# EAGLE design HPLEDShield-v2.5 (EAGLE 6.4)
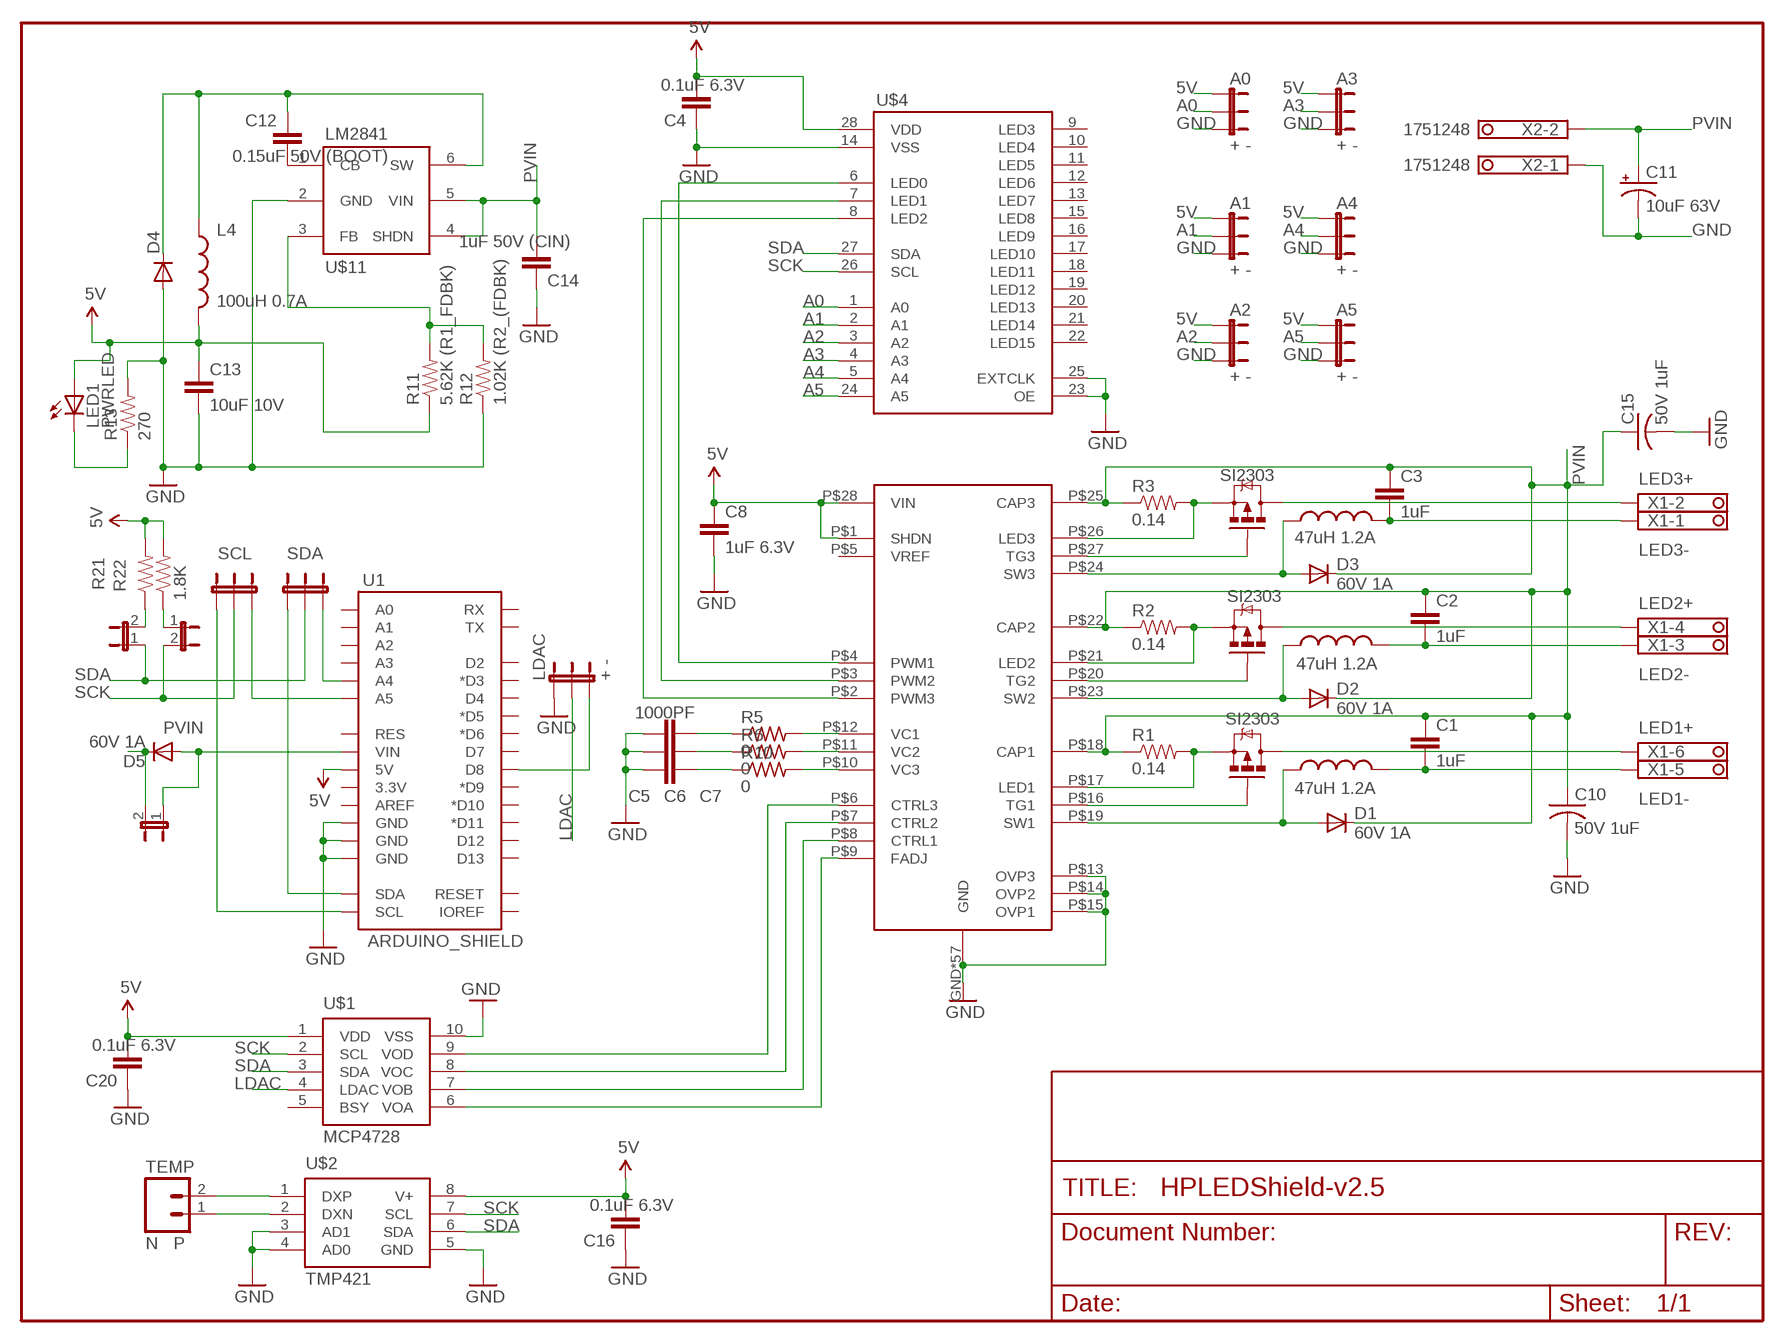
[diagram p0: schematic, sheet 1]

## Parts
A0  + -  JUMPER-3SMD  [SJ_3]
A1  + -  JUMPER-3SMD  [SJ_3]
A2  + -  JUMPER-3SMD  [SJ_3]
A3  + -  JUMPER-3SMD  [SJ_3]
A4  + -  JUMPER-3SMD  [SJ_3]
A5  + -  JUMPER-3SMD  [SJ_3]
C1  1uF  CAP0805  [0805]
C2  1uF  CAP0805  [0805]
C3  1uF  CAP0805  [0805]
C4  0.1uF 6.3V  CAP0402-CAP  [0402-CAP]
C5  1000PF  CAP0402-CAP  [0402-CAP]
C6  1000PF  CAP0402-CAP  [0402-CAP]
C7  1000PF  CAP0402-CAP  [0402-CAP]
C8  1uF 6.3V  CAP0402-CAP  [0402-CAP]
C10  50V 1uF  C-USC1210  [C1210]
C11  10uF 63V  CAP_POLD  [PANASONIC_D]
C12  0.15uF 50V (BOOT)  CAP0603-CAP  [0603-CAP]
C13  10uF 10V  CAP0805  [0805]
C14  1uF 50V (CIN)  CAP1206  [1206]
C15  50V 1uF  C-USC1210  [C1210]
C16  0.1uF 6.3V  CAP0402-CAP  [0402-CAP]
C20  0.1uF 6.3V  CAP0402-CAP  [0402-CAP]
D1  60V 1A  DIODES0D123  [SOD123]
D2  60V 1A  DIODES0D123  [SOD123]
D3  60V 1A  DIODES0D123  [SOD123]
D4  DIODE-SCHOTTKY_ 60V 1A  DIODES0D123  [SOD123]
D5  60V 1A  DIODES0D123  [SOD123]
JP1  PWM3  JUMPER-2SMD-NO  [SJ_2S-NO]
JP2  PWM3  JUMPER-2SMD-NC  [SJ_2S]
JP3  PWM3  JUMPER-2SMD-NC  [SJ_2S]
L1  47uH 1.2A  INDUCTORELL8  [ELL8TP]
L2  47uH 1.2A  INDUCTORELL8  [ELL8TP]
L3  47uH 1.2A  INDUCTORELL8  [ELL8TP]
L4  100uH 0.7A  INDUCTOR6UH  [ELL6UH]
LDAC  + -  JUMPER-3SMD  [SJ_3]
LED1  PWRLED  LED0603  [LED-0603]
LT3496  LT3496  [LT3694_TSSOP]
Q1  SI2303  [SOT-23]
Q2  SI2303  [SOT-23]
Q3  SI2303  [SOT-23]
R1  0.14  RESISTOR0603-RES  [0603-RES]
R2  0.14  RESISTOR0603-RES  [0603-RES]
R3  0.14  RESISTOR0603-RES  [0603-RES]
R5  0  R-US_R0402  [R0402]
R6  0  R-US_R0402  [R0402]
R10  0  R-US_R0402  [R0402]
R11  5.62K (R1_FDBK)  RESISTOR0603-RES  [0603-RES]
R12  1.02K (R2_(FDBK)  RESISTOR0603-RES  [0603-RES]
R13  270  RESISTOR0603-RES  [0603-RES]
R21  1.8K  RESISTOR0402-RES  [0402-RES]
R22  1.8K  RESISTOR0402-RES  [0402-RES]
SCL  JUMPER-3SMD  [SJ_3]
SDA  JUMPER-3SMD  [SJ_3]
TEMP  N P  M02PTH  [1X02]
U1  ARDUINO_SHIELD  ARDUINO_SHIELDNO_SILK  [DUEMILANOVE_VIAS]
U$1  MCP4728  [MSOP10]
U$2  TMP421  [SOT23-8]
U$4  PCA9685  [TSSOP28]
U$11  LM2841  [TSOT-6]
X1  LED1+  1751280  [1751280]
X2  1751248  [1751248]

## Nets
5V: A0.1 A1.1 A2.1 A3.1 A4.1 A5.1 C4.2 C8.1 C13.1 C16.2 C20.2 L4.P$2 LED1.A LT3496.P$1(SHDN) LT3496.P$28(VIN) R11.1 R21.2 R22.2 U1.5V U$1.1(VDD) U$2.8(V+) U$4.28(VDD)
A0: A0.2 U$4.1(A0)
A1: A1.2 U$4.2(A1)
A2: A2.2 U$4.3(A2)
A3: A3.2 U$4.4(A3)
A4: A4.2 U$4.5(A4)
A5: A5.2 U$4.24(A5)
GND: A0.3 A1.3 A2.3 A3.3 A4.3 A5.3 C4.1 C5.1 C6.1 C7.1 C8.2 C10.2 C11.- C13.2 C14.1 C15.2 C16.1 C20.1 D4.2(A) LDAC.1 LT3496.GND LT3496.P$13(OVP3) LT3496.P$14(OVP2) LT3496.P$15(OVP1) LT3496.P$29(GND) LT3496.P$30(GND) LT3496.P$31(GND) LT3496.P$32(GND) LT3496.P$33(GND) LT3496.P$34(GND) LT3496.P$35(GND) LT3496.P$36(GND) LT3496.P$37(GND) LT3496.P$38(GND) LT3496.P$39(GND) LT3496.P$40(GND) LT3496.P$41(GND) LT3496.P$42(GND) LT3496.P$43(GND) LT3496.P$44(GND) LT3496.P$45(GND) LT3496.P$46(GND) LT3496.P$47(GND) LT3496.P$48(GND) LT3496.P$49(GND) LT3496.P$50(GND) LT3496.P$51(GND) LT3496.P$52(GND) LT3496.P$53(GND) LT3496.P$54(GND) LT3496.P$55(GND) LT3496.P$56(GND) LT3496.P$57(GND) LT3496.P$58(GND) LT3496.P$59(GND) LT3496.P$60(GND) LT3496.P$61(GND) LT3496.P$62(GND) LT3496.P$63(GND) LT3496.P$64(GND) LT3496.P$65(GND) LT3496.P$66(GND) LT3496.P$67(GND) LT3496.P$68(GND) LT3496.P$69(GND) LT3496.P$70(GND) LT3496.P$71(GND) LT3496.P$72(GND) LT3496.P$73(GND) LT3496.P$74(GND) LT3496.P$75(GND) LT3496.P$76(GND) LT3496.P$77(GND) LT3496.P$78(GND) LT3496.P$79(GND) LT3496.P$80(GND) LT3496.P$81(GND) LT3496.P$82(GND) LT3496.P$83(GND) LT3496.P$84(GND) R12.1 R13.2 U1.GND@0(GND) U1.GND@1(GND) U1.GND@2(GND) U$1.10(VSS) U$2.3(AD1) U$2.4(AD0) U$2.5(GND) U$4.14(VSS) U$4.23(OE) U$4.25(EXTCLK) U$11.2(GND) X2.1
LDAC: LDAC.2 U$1.4(LDAC)
N$1: JP2.2 R21.1
N$2: JP3.1 R22.1
N$3: LT3496.P$12(VC1) R5.2
N$4: LT3496.P$11(VC2) R6.2
N$5: LT3496.P$10(VC3) R10.2
N$6: C7.2 R5.1
N$7: LDAC.3 U1.D8
N$8: C6.2 R6.1
N$9: C5.2 R10.1
N$10: LT3496.P$8(CTRL1) U$1.7(VOB)
N$11: TEMP.2 U$2.1(DXP)
N$12: TEMP.1 U$2.2(DXN)
N$14: C12.1 D4.1(C) L4.P$1 U$11.6(SW)
N$15: LT3496.P$7(CTRL2) U$1.8(VOC)
N$16: LT3496.P$21(LED2) Q2.2(S) R2.2
N$17: LT3496.P$9(FADJ) U$1.6(VOA)
N$18: LT3496.P$26(LED3) Q3.2(S) R3.2
N$19: LT3496.P$27(TG3) Q3.1(G)
N$20: LT3496.P$6(CTRL3) U$1.9(VOD)
N$21: D3.2(A) L3.P$1 LT3496.P$24(SW3)
N$22: C1.2 L1.P$2 X1.5
N$23: LED1.C R13.1
N$25: C12.2 U$11.1(CB)
N$26: SDA.1 U1.SDA
N$27: SCL.1 U1.SCL
N$29: SDA.3 U1.A4
N$30: SCL.3 U1.A5
N$32: R11.2 R12.2 U$11.3(FB)
N$34: D2.2(A) L2.P$1 LT3496.P$23(SW2)
N$36: Q3.3(D) X1.2
N$38: D1.2(A) L1.P$1 LT3496.P$19(SW1)
N$39: LT3496.P$20(TG2) Q2.1(G)
N$40: C3.2 L3.P$2 X1.1
N$42: LT3496.P$17(LED1) Q1.2(S) R1.2
N$46: LT3496.P$16(TG1) Q1.1(G)
N$58: C2.2 L2.P$2 X1.3
N$63: Q2.3(D) X1.4
N$69: Q1.3(D) X1.6
PVIN: C1.1 C2.1 C3.1 C10.1 C11.+ C14.2 C15.1 D1.1(C) D2.1(C) D3.1(C) D5.1(C) JP1.2 LT3496.P$18(CAP1) LT3496.P$22(CAP2) LT3496.P$25(CAP3) R1.1 R2.1 R3.1 U$11.4(SHDN) U$11.5(VIN) X2.2
PWM1: LT3496.P$4(PWM1) U$4.6(LED0)
PWM2: LT3496.P$3(PWM2) U$4.7(LED1)
PWM3: LT3496.P$2(PWM3) U$4.8(LED2)
SCK: JP3.2 SCL.2 U$1.2(SCL) U$2.7(SCL) U$4.26(SCL)
SDA: JP2.1 SDA.2 U$1.3(SDA) U$2.6(SDA) U$4.27(SDA)
VIN: D5.2(A) JP1.1 U1.VIN
Unconnected: LT3496.P$5(VREF) U1.3.3V U1.A0 U1.A1 U1.A2 U1.A3 U1.AREF U1.D2 U1.D3(*D3) U1.D4 U1.D5(*D5) U1.D6(*D6) U1.D7 U1.D9(*D9) U1.D10(*D10) U1.D11(*D11) U1.D12 U1.D13 U1.IOREF U1.RES$1(RESET) U1.RESET(RES) U1.RX U1.TX U$1.5(BSY) U$4.9(LED3) U$4.10(LED4) U$4.11(LED5) U$4.12(LED6) U$4.13(LED7) U$4.15(LED8) U$4.16(LED9) U$4.17(LED10) U$4.18(LED11) U$4.19(LED12) U$4.20(LED13) U$4.21(LED14) U$4.22(LED15)

## Notes on the sheet
- LED3+
- LED3-
- LED2+
- LED2-
- LED1+
- LED1-

## Library data of the parts
A0 A1-A5 LDAC SCL SDA = SparkFun:JUMPER-3
C1-C8 C12-C14 C16 C20 = SparkFun:CAP: Capacitor Standard 0603 ceramic capacitor, and 0.1" leaded capacitor.
C10 C15 = rcl:C-US: CAPACITOR, American symbol
C11 = SparkFun:CAP_POL: Capacitor Polarized These are standard SMD and PTH capacitors. Normally 10uF, 47uF, and 100uF in electrolytic and tantalum varieties. Always verify the external diameter of the through hole cap, it varies with capacity, voltage, and manufacturer. The EIA devices should be standard.
D1-D5 = SparkFun:DIODE: Diode These are standard reverse protection diodes and small signal diodes. SMA package can handle up to about 1A. SOD-323 can handle about 200mA. What the SOD-323 package when ordering, there are some mfgs out there that are 5-pin packages.
JP1-JP3 = SparkFun:JUMPER-2: Jumper Basic 0.1" spaced jumper. Use with breakaway headers.
L1-L3 = Peters_Library:INDUCTOR: Inductors Basic Inductor/Choke - 0603 and 1206. Footprints are not proven and vary greatly between part numbers.
L4 = SparkFun:INDUCTOR: Inductors Basic Inductor/Choke - 0603 and 1206. Footprints are not proven and vary greatly between part numbers.
LED1 = SparkFun:LED: LEDs Standard schematic elements and footprints for 5mm, 3mm, 1206, and 0603 sized LEDs. 5mm - Spark Fun Electronics SKU : COM-00529 (and others)
LT3496 = Peters_Library:LT3496
Q1-Q3 = mylib:SI2303
R1-R3 R11-R13 R21 R22 = SparkFun:RESISTOR: Resistor Basic schematic elements and footprints for 0603, 1206, and PTH 1/10th watt (small) resistors.
R5 R6 R10 = resistor:R-US_: RESISTOR, American symbol
TEMP = SparkFun:M02: Header 2 Standard 2-pin 0.1" header. Use with straight break away headers (SKU : PRT-00116), right angle break away headers (PRT-00553), swiss pins (PRT-00743), machine pins (PRT-00117), and female headers (PRT-00115). Molex polarized connector foot print use with SKU : PRT-08233 with associated crimp pins and housings.
U1 = Peters_Library:ARDUINO_SHIELD
U$1 = mylib:MCP4728
U$2 = mylib:TMP421
U$4 = mylib:PCA9685
U$11 = SparkFun:LM2841
X1 = con-phoenix-350:1751280: MKDS 1/ 6-3,5 Printklemme Nennstrom: 10 A Bemessungsspannung: 160 V Raster: 3,5 mm Polzahl: 6 Montageart: Löten Anschlussart: Schraubanschluss Anschlussrichtung vom Leiter zur Platine: 0° Source: http://eshop.phoenixcontact.com .. 1751280.pdf; MPN: 1751280; OC_FARNELL: unknown; OC_NEWARK: 27R1765
X2 = con-phoenix-350:1751248: MKDS 1/ 2-3,5 Printklemme Nennstrom: 10 A Bemessungsspannung: 160 V Raster: 3,5 mm Polzahl: 2 Montageart: Löten Anschlussart: Schraubanschluss Anschlussrichtung vom Leiter zur Platine: 0° Source: http://eshop.phoenixcontact.com .. 1751248.pdf; OC_FARNELL: unknown; OC_NEWARK: unknown

## Board
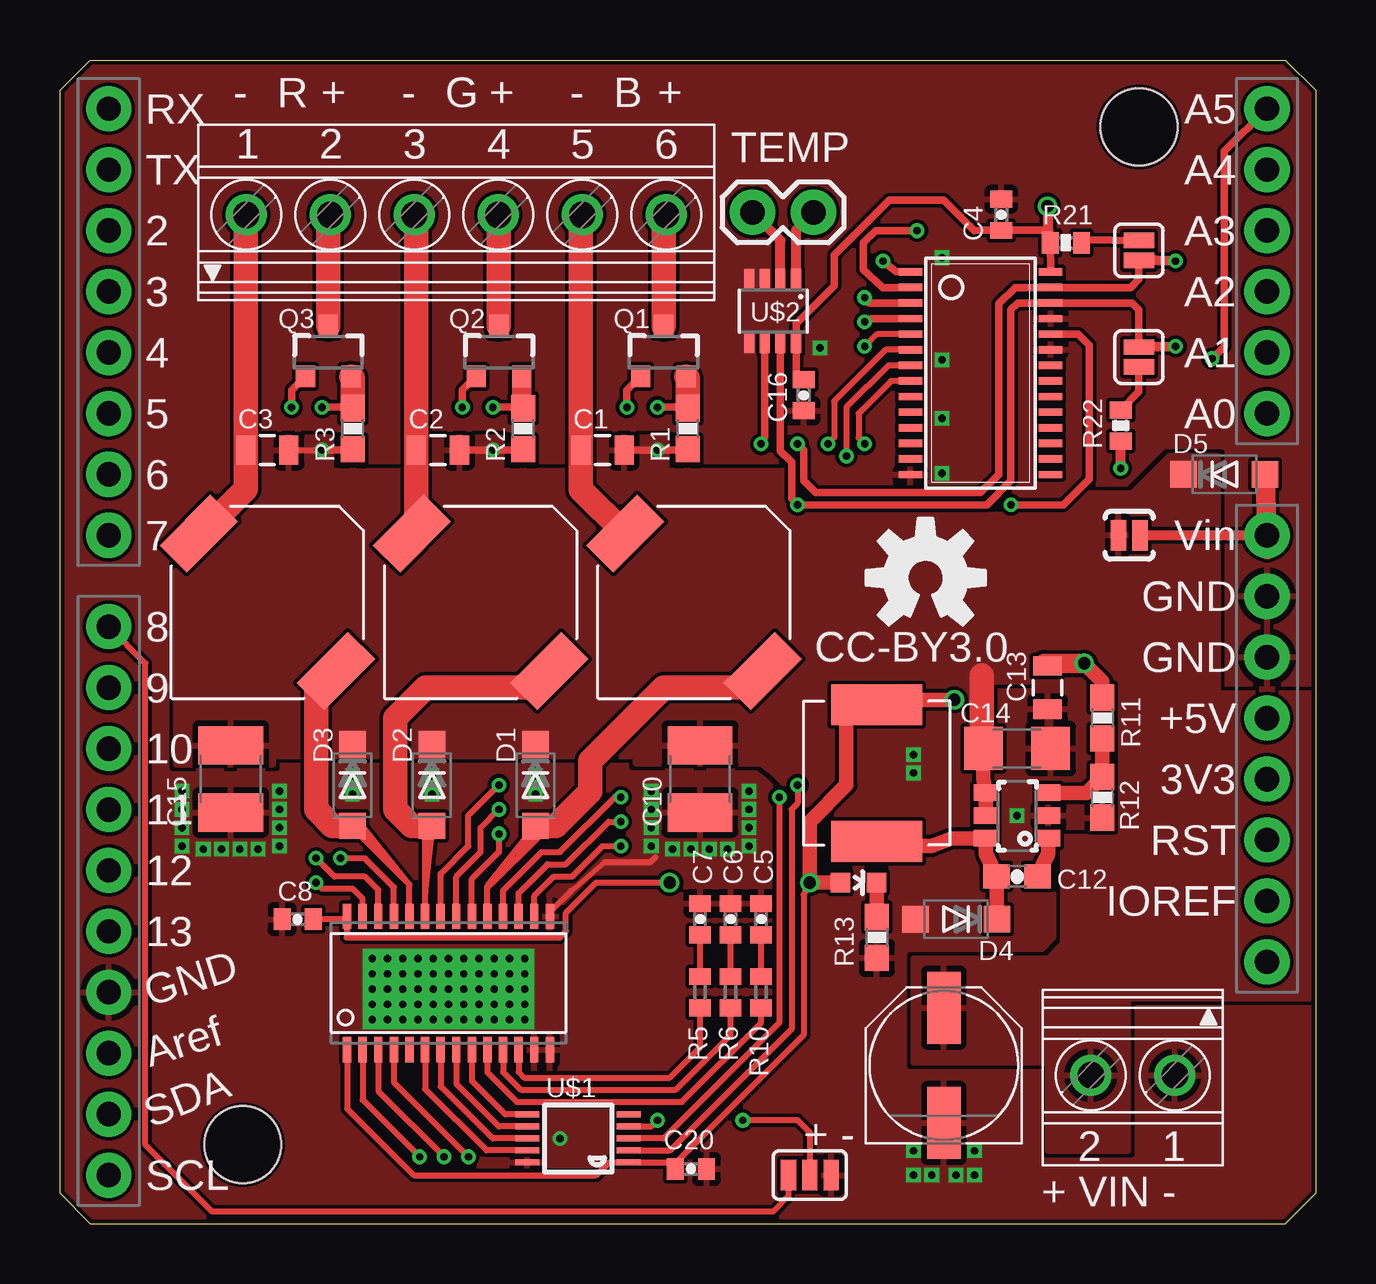
[diagram p1: board, top side]
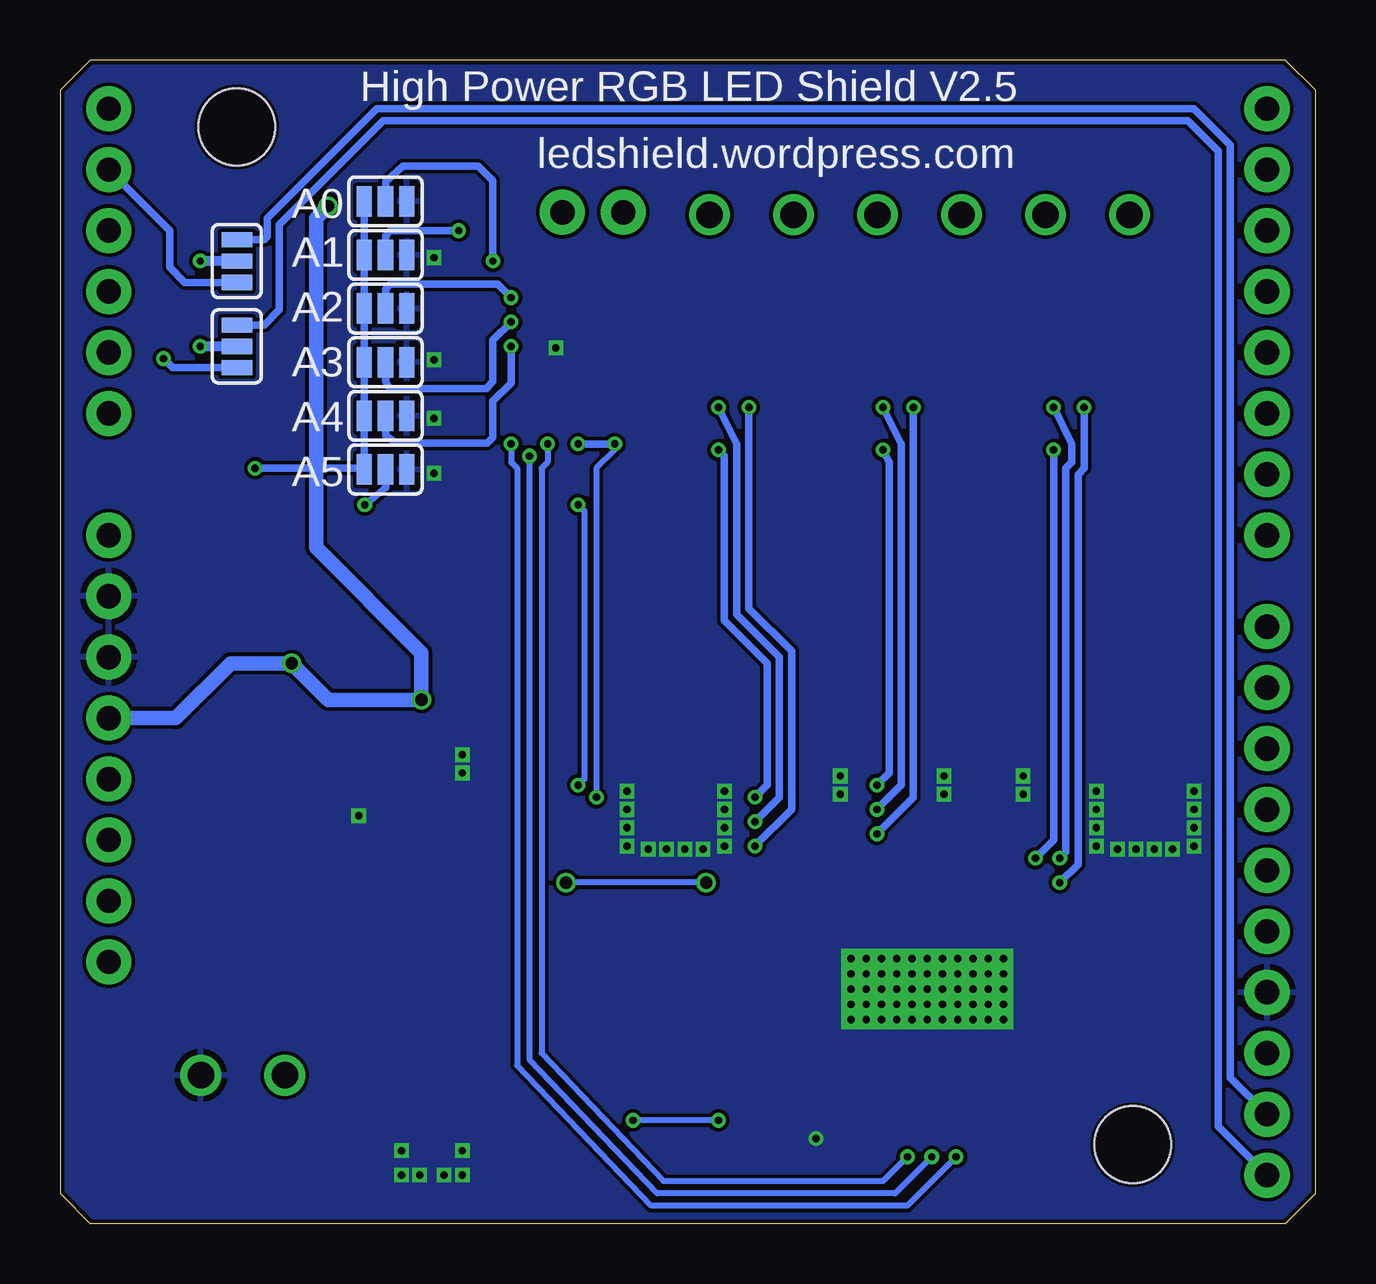
[diagram p2: board, bottom side, seen from below]

Size 52.32 x 48.51 mm. Coordinates in mm from the lower left corner, seen from the top.
Outline: 51.05,48.51 52.32,47.24 52.32,1.27 51.05,0 1.27,0 0,1.27 0,47.24 1.27,48.51 51.05,48.51
Copper layers (1*16): Top 0.035mm / dielectric 1.5mm / Bottom 0.035mm
Design rules "hackvana": minimum track width 6mil, minimum drill 0.3mm, track to track 6mil, track to pad 6mil, pad to pad 6mil, via to via 6mil, smd to smd 0mil, copper to edge 6mil, drill to drill 6mil, minimum pad ring 10mil, minimum via ring 6mil, stop-mask expansion 2mil, vias tented up to drill 100mil, thermal gap 10mil
Holes 3.2 mm at 7.62,3.3 44.96,45.72

### Footprints (pad centres in the part's own frame; a part is rotated, then mirrored left to right if it is on the bottom)
SJ_3 = smd 0.635 x 1.27: 1 -0.889,0; 2 0,0; 3 0.889,0
0805 = smd 0.8 x 1.2: 1 -0.9,0; 2 0.9,0
0402-CAP = smd 0.7 x 0.9: 1 -0.65,0; 2 0.65,0
C1210 = smd 1.6 x 2.7: 1 -1.4,0; 2 1.4,0
PANASONIC_D = smd 3 x 1.4: + 2.4,0; - -2.4,0
0603-CAP = smd 1.1 x 1: 1 -0.85,0; 2 0.85,0
1206 = smd 1.6 x 1.8: 1 -1.4,0; 2 1.4,0
SOD123 = smd 1.1 x 1.1: 1 -1.7,0; 2 1.7,0
SJ_2S-NO = smd 0.635 x 1.27: 1 -0.45,0; 2 0.45,0
SJ_2S = smd 0.635 x 1.27: 1 -0.412,0; 2 0.412,0
ELL8TP = smd 3 x 1.6 rotated 315: P$1 -2.864,-2.864; P$2 2.864,2.864
ELL6UH = smd 1.7 x 3.8: P$1 -2.86,0; P$2 2.84,0
LED-0603 = smd 0.8 x 0.8: A 0,-0.75; C 0,0.75
LT3694_TSSOP = smd 4.75 x 2.74: GND 0,0 | smd 0.35 x 1.05: P$1 -4.225,-2.775; P$2 -3.575,-2.775; P$3 -2.925,-2.775; P$4 -2.275,-2.775; P$5 -1.625,-2.775; P$6 -0.975,-2.775; P$7 -0.325,-2.775; P$8 0.325,-2.775; P$9 0.975,-2.775; P$10 1.625,-2.775; P$11 2.275,-2.775; P$12 2.925,-2.775; P$13 3.575,-2.775; P$14 4.225,-2.775; P$15 4.225,2.775; P$16 3.575,2.775; P$17 2.925,2.775; P$18 2.275,2.775; P$19 1.625,2.775; P$20 0.975,2.775; P$21 0.325,2.775; P$22 -0.325,2.775; P$23 -0.975,2.775; P$24 -1.625,2.775; P$25 -2.275,2.775; P$26 -2.925,2.775; P$27 -3.575,2.775; P$28 -4.225,2.775 | drill 0.305 square: P$29 -2.54,0.381; P$30 -2.54,1.016; P$31 -2.54,-0.254; P$32 -2.54,-0.889; P$33 -2.54,-1.524; P$34 -1.905,1.016; P$35 -1.905,0.381; P$36 -1.905,-0.254; P$37 -1.905,-0.889; P$38 -1.905,-1.524; P$39 -1.27,1.016; P$40 -1.27,0.381; P$41 -1.27,-0.254; P$42 -1.27,-0.889; P$43 -1.27,-1.524; P$44 -0.635,1.016; P$45 -0.635,0.381; P$46 -0.635,-0.254; P$47 -0.635,-0.889; P$48 -0.635,-1.524; P$49 0,1.016; P$50 0,0.381; P$51 0,-0.254; P$52 0,-0.889; P$53 0,-1.524; P$54 0.635,1.016; P$55 0.635,0.381; P$56 0.635,-0.254; P$57 0.635,-0.889; P$58 0.635,-1.524; P$59 1.27,1.016; P$60 1.27,0.381; P$61 1.27,-0.254; P$62 1.27,-0.889; P$63 1.27,-1.524; P$64 1.905,1.016; P$66 1.905,0.381; P$67 1.905,-0.254; P$68 1.905,-0.889; P$69 1.905,-1.524; P$70 2.54,1.016; P$71 2.54,0.381; P$72 2.54,-0.254; P$73 2.54,-0.889; P$74 2.54,-1.524; P$75 -3.175,1.016; P$76 -3.175,0.381; P$77 -3.175,-0.254; P$78 -3.175,-0.889; P$79 -3.175,-1.524; P$80 3.175,1.016; P$81 3.175,0.381; P$82 3.175,-0.254; P$83 3.175,-0.889; P$84 3.175,-1.524 | smd 4.75 x 2.74 bottom: P$65 0,0
SOT-23 = smd 0.8 x 0.9: 1 -0.95,-1; 2 0.95,-1; 3 0,1.1
0603-RES = smd 1.1 x 1: 1 -0.85,0; 2 0.85,0
R0402 = smd 0.7 x 0.9: 1 -0.65,0; 2 0.65,0
0402-RES = smd 0.7 x 0.9: 1 -0.65,0; 2 0.65,0
1X02 = drill 1.016 pad 1.88: 1 0,0; 2 2.54,0
DUEMILANOVE_VIAS = drill 1.016 pad 1.88: 3.3V 50.8,13.97; 5V 50.8,16.51; A0 50.8,29.21; A1 50.8,31.75; A2 50.8,34.29; A3 50.8,36.83; A4 50.8,39.37; A5 50.8,41.91; AREF 2.54,2.54; D2 2.54,36.83; D3 2.54,34.29; D4 2.54,31.75; D5 2.54,29.21; D6 2.54,26.67; D7 2.54,24.13; D8 2.54,20.32; D9 2.54,17.78; D10 2.54,15.24; D11 2.54,12.7; D12 2.54,10.16; D13 2.54,7.62; GND@0 50.8,19.05; GND@1 50.8,21.59; GND@2 2.54,5.08; IOREF 50.8,8.89; RES$1 50.8,6.35; RESET 50.8,11.43; RX 2.54,41.91; SCL 2.54,-2.54; SDA 2.54,0; TX 2.54,39.37; VIN 50.8,24.13
MSOP10 = smd 1 x 0.25: 1 -2.113,1; 2 -2.113,0.5; 3 -2.113,0; 4 -2.113,-0.5; 5 -2.113,-1; 6 2.113,-1; 7 2.113,-0.5; 8 2.113,0; 9 2.113,0.5; 10 2.113,1
SOT23-8 = smd 0.42 x 0.8: 1 -0.95,-1.55; 2 -0.3,-1.55; 3 0.35,-1.55; 4 1,-1.55; 5 1,1.15; 6 0.35,1.15; 7 -0.3,1.15; 8 -0.95,1.15
TSSOP28 = smd 0.305 x 0.991: 1 -4.225,-2.918; 2 -3.575,-2.918; 3 -2.925,-2.918; 4 -2.275,-2.918; 5 -1.625,-2.918; 6 -0.975,-2.918; 7 -0.325,-2.918; 8 0.325,-2.918; 9 0.975,-2.918; 10 1.625,-2.918; 11 2.275,-2.918; 12 2.925,-2.918; 13 3.575,-2.918; 14 4.225,-2.918; 15 4.225,2.918; 16 3.575,2.918; 17 2.925,2.918; 18 2.275,2.918; 19 1.625,2.918; 20 0.975,2.918; 21 0.325,2.918; 22 -0.325,2.918; 23 -0.975,2.918; 24 -1.625,2.918; 25 -2.275,2.918; 26 -2.925,2.918; 27 -3.575,2.918; 28 -4.225,2.918
TSOT-6 = smd 0.69 x 1: 1 -0.95,-1.3; 2 0,-1.3; 3 0.95,-1.3; 4 0.95,1.3; 5 0,1.3; 6 -0.95,1.3
1751280 = drill 1.1 pad 1.7: 1 -8.75,-0.1; 2 -5.25,-0.1; 3 -1.75,-0.1; 4 1.75,-0.1; 5 5.25,-0.1; 6 8.75,-0.1
1751248 = drill 1.1 pad 1.7: 1 -1.75,-0.1; 2 1.75,-0.1

### Placement (x,y rotation side)
A0  38.76,42.62 0 bottom
A1  38.76,40.39 0 bottom
A2  38.76,38.15 0 bottom
A3  38.76,35.92 0 bottom
A4  38.76,33.68 0 bottom
A5  38.76,31.45 0 bottom
C1  22.61,32.26 180 top
C2  15.75,32.26 180 top
C3  8.64,32.26 180 top
C4  39.22,42.06 270 top
C5  29.21,12.7 270 top
C6  27.94,12.7 270 top
C7  26.67,12.7 270 top
C8  9.91,12.7 180 top
C10  26.67,18.54 270 top
C11  36.83,6.6 90 top
C12  39.88,14.48 0 top
C13  41.15,22.35 270 top
C14  39.88,19.81 180 top
C15  7.11,18.54 270 top
C16  30.99,34.54 90 top
C20  26.29,2.29 180 top
D1  19.81,18.29 270 top
D2  15.49,18.29 270 top
D3  12.19,18.29 270 top
D4  37.34,12.7 180 top
D5  48.51,31.24 0 top
JP1  44.55,28.7 180 top
JP2  44.96,40.58 90 top
JP3  44.96,36.13 90 top
L1  26.42,25.91 90 top
L2  17.53,25.91 90 top
L3  8.64,25.91 90 top
L4  34.04,18.8 90 top
LDAC  31.24,2.03 180 top
LED1  33.27,14.22 270 top
LT3496  16.19,10.04 0 top
Q1  25.15,36.32 0 top
Q2  18.29,36.32 0 top
Q3  11.18,36.32 0 top
R1  26.16,33.15 90 top
R2  19.3,33.15 90 top
R3  12.2,33.15 90 top
R5  26.67,9.65 270 top
R6  27.94,9.65 270 top
R10  29.21,9.65 270 top
R11  43.43,21.08 270 top
R12  43.43,17.78 90 top
R13  34.04,11.94 270 top
R21  41.91,40.89 180 top
R22  44.2,33.27 270 top
SCL  44.96,36.58 270 bottom
SDA  44.96,40.13 270 bottom
TEMP  28.85,42.16 0 top
U1  -0.51,4.57 0 top
U$1  21.59,3.56 180 top
U$2  29.72,37.85 180 top
U$4  38.35,35.46 270 top
U$7  [OSHW-LOGO-M]  36.07,26.92 0 top
U$11  39.88,17.02 90 top
X1  16.51,42.16 0 top
X2  44.7,6.1 180 top

### Tracks (layer width: path | path; a pad name or v marks a point on that pad's centre or on a via)
5V  (via drill 0.3, 0.51)
  Top 0.254: v25.4,14.22 22.35,14.22 21.08,12.95 21.08,12.19 20.83,11.94 11.94,11.94 11.94,12.79 | v31.24,14.22 30.99,13.72 30.99,7.87 25.64,2.52 C20.2 25.64,2.56 U$1.1 22.88,2.56 22.35,2.03 14.73,2.03 11.96,4.8 LT3496.P$1 | 11.94,12.79 LT3496.P$28 | 11.94,12.79 11.85,12.7 C8.1
  Top 0.305: C16.2 30.67,35.51 U$2.8 30.67,37.53 32.26,39.12 32.26,40.39 34.54,42.67 36.83,42.67 38.1,41.4 38.36,41.41 C4.2 41.15,41.41 41.25,41.41 R21.2 U$4.28 41.51,39.68
  Top 0.406: v44.2,31.5 R22.2 | v41.15,42.42 41.15,41.41
  Top 0.61: R11.1 43.43,22.61 v42.67,23.37 | C13.1 41.01,23.37 | LED1.A v31.24,14.22 31.24,16.76 32.77,18.29 32.77,21.84 32.47,21.89 L4.P$2 34.59,21.64 34.8,21.84 v37.26,21.84
  Top 0.813: 41.01,23.37 v42.67,23.37
  Bottom 0.254: v25.4,14.22 v31.24,14.22
  Bottom 0.305: v44.2,31.5 41.66,31.5 39.7,31.5 A5.1 A4.1 A3.1 A2.1 A1.1 A0.1
  Bottom 0.61: U1.5V 47.5,21.08 45.21,23.37 v42.67,23.37 41.15,21.84 v37.26,21.84 37.26,23.8 41.66,28.19 41.66,31.24 41.66,31.5 41.66,41.91 v41.15,42.42
A0  (via drill 0.3)
  Top 0.305: U$4.1 34.84,39.68 v34.29,40.13
  Bottom 0.305: A0.2 38.76,43.43 38.05,44.09 34.9,44.09 34.29,43.48 v34.29,40.13
A1  (via drill 0.3)
  Top 0.305: U$4.2 34.27,39.03 33.48,39.78 33.48,40.89 33.98,41.4 v35.71,41.4
  Bottom 0.305: A1.2 38.76,41.2 38.56,41.4 v35.71,41.4
A2  (via drill 0.3)
  Top 0.305: U$4.3 33.73,38.38 v33.53,38.61
  Bottom 0.305: A2.2 38.76,38.96 38.56,39.17 34.09,39.17 v33.53,38.61
A3  (via drill 0.3)
  Top 0.305: U$4.4 33.8,37.73 v33.53,37.59
  Bottom 0.305: A3.2 38.76,35.1 38.58,34.82 34.57,34.82 34.29,35.1 34.29,36.83 v33.53,37.59
A4  (via drill 0.3)
  Top 0.254: U$4.5 34.03,37.08 v33.53,36.58
  Bottom 0.305: A4.2 38.76,32.87 38.3,32.54 35.23,32.54 34.52,32.54 34.29,32.77 34.29,34.29 33.53,35.05 v33.53,36.58
A5  (via drill 0.3)
  Top 0.305: U$4.24 42.42,37.08 42.88,36.63 42.88,31.04 41.81,29.97 v39.62,29.97
  Bottom 0.305: v39.62,29.97 38.76,30.68 A5.2
GND  (via drill 0.3)
  Top 0.203: 21.29,13.88 22.69,15.08
  Top 0.254: 20.41,13 LT3496.P$15 20.41,13 | 21.29,13.88 20.41,13 | 22.69,15.08 24.61,15.08 24.81,15.28
  other vias: 5.08,18.03 5.08,17.27 5.08,16.51 5.08,15.75 5.97,15.62 6.73,15.62 7.49,15.62 8.26,15.62 12.19,18.67 12.19,17.91 15.49,18.67 15.49,17.91 19.81,18.67 19.81,17.91 38.1,3.05 36.74,33.57 36.74,36.01 36.74,40.28 9.14,18.03 9.14,17.27 9.14,16.51 9.14,15.75 36.74,31.28 39.88,17.02 35.56,19.56 35.56,18.8 31.66,36.52 38.1,2.03 37.34,2.03 36.32,2.03 35.56,2.03 35.56,3.05 20.83,3.56 24.64,18.03 24.64,17.27 24.64,16.51 24.64,15.75 25.53,15.62 26.29,15.62 27.05,15.62 27.81,15.62 28.7,18.03 28.7,17.27 28.7,16.51 28.7,15.75
  pour Top (rank 2): 55.58,51.46 -0.51,51.46 -0.51,-3.56 55.58,-3.56
  pour Bottom: 54.36,50.55 -0.51,50.55 -0.51,-1.78 54.36,-1.78
LDAC  (via drill 0.3)
  Top 0.254: U$1.4 24.63,4.06 v24.89,4.32 | LDAC.2 31.24,3.81 30.73,4.32 v28.45,4.32
  Bottom 0.254: v24.89,4.32 v28.45,4.32
N$1
  Top 0.305: JP2.2 42.69,41.03 R21.1
N$2
  Top 0.305: R22.1 44.96,34.69 JP3.1
N$3
  Top 0.254: R5.2 26.67,7.37 25.4,6.1 19.34,6.1 19.11,6.33 LT3496.P$12
N$4
  Top 0.254: 28.04,8.94 28.02,8.96 | R6.2 27.94,7.87 25.65,5.59 19.19,5.59 18.46,6.32 LT3496.P$11
  Top 0.305: R6.2 28.04,9.03 28.04,8.94
N$5
  Top 0.254: R10.2 29.21,8.38 25.91,5.08 19.04,5.08 17.81,6.31 LT3496.P$10
N$6
  Top 0.254: R5.1 C7.2
N$7
  Top 0.254: LDAC.3 30.35,1.14 29.72,0.51 6.35,0.51 3.56,3.3 3.56,23.37 U1.D8
N$8
  Top 0.254: R6.1 C6.2
N$9
  Top 0.254: R10.1 C5.2
N$10
  Top 0.254: U$1.7 18.3,4.06 18.29,4.06 16.51,5.84 LT3496.P$8
N$11
  Top 0.406: U$2.1 30.67,41.44 TEMP.2
N$12
  Top 0.406: U$2.2 30.02,41 TEMP.1
N$14
  Top 0.61: L4.P$1 35.37,15.75 36.32,15.75 37.15,16.07 37.46,16.07 U$11.6 38.58,15.44 C12.1 39.03,12.7 D4.1
N$15
  Top 0.254: U$1.8 18.03,3.56 15.86,5.73 LT3496.P$7
N$16  (via drill 0.3)
  Top 0.254: v18.29,17.27 17.53,16.51 17.53,15.49 16.51,14.48 LT3496.P$21
  Top 0.305: v18.03,34.04 19.27,34.04 R2.2
  Top 0.813: 19.27,34.04 arc-90 19.24,34.06 Q2.2
  Bottom 0.305: v18.29,17.27 17.27,18.29 17.27,32.51 v18.03,34.04
N$17
  Top 0.254: U$1.6 18.56,4.56 18.54,4.57 17.16,5.95 LT3496.P$9
N$18  (via drill 0.3)
  Top 0.254: v10.67,15.24 11.43,14.48 12.7,14.48 13.26,13.92 LT3496.P$26
  Top 0.305: 12.03,33.78 arc90 R3.2 arc90 12.11,34.04 v10.92,34.04
  Top 1.016: R3.2 12.2,35.25 Q3.2
  Bottom 0.305: v10.67,15.24 10.41,15.49 10.41,31.5 10.16,31.75 10.16,32.51 v10.92,34.04
N$19  (via drill 0.3)
  Top 0.254: v10.67,14.22 10.92,13.97 12.19,13.97 12.61,13.55 LT3496.P$27
  Top 0.305: v9.65,34.04 9.65,34.75 Q3.1
  Bottom 0.305: v10.67,14.22 9.91,14.99 9.91,31.24 9.65,31.5 v9.65,34.04
N$20
  Top 0.254: U$1.9 17.77,3.06 15.21,5.62 LT3496.P$6
N$21
  Top 0.254: 14.48,14.22 12.19,16.51 D3.2 | 14.48,14.22 12.45,16.51 | 14.48,14.22 12.45,16.76 | LT3496.P$24 14.56,14.14 14.48,14.22
  Top 1.016: D3.2 11.35,16.59 10.67,17.27 10.67,22.21 L3.P$1
N$22
  Top 1.016: X1.5 21.71,42.01 C1.2 21.71,30.62 L1.P$2
N$23
  Top 0.61: LED1.C 34.04,14.21 R13.1
N$25
  Top 0.61: C12.2 41.18,15.44 U$11.1
N$26
  Bottom 0.305: U1.SDA 3.56,6.1 3.56,44.96 5.08,46.48 39.12,46.48 43.69,41.91 43.69,41.15 43.81,41.02 SDA.1
N$27
  Bottom 0.305: U1.SCL 4.06,4.06 4.06,44.7 5.33,45.97 38.86,45.97 43.18,41.66 43.18,38.1 43.81,37.47 SCL.1
N$29
  Bottom 0.305: SDA.3 47.12,39.24 47.75,39.88 47.75,41.4 U1.A4
N$30  (via drill 0.3)
  Top 0.305: U1.A5 48.51,44.7 48.51,36.58 v48.01,36.07
  Bottom 0.305: SCL.3 47.62,35.69 v48.01,36.07
N$32
  Top 0.61: R11.2 R12.2 42.77,17.97 U$11.3
N$34
  Top 0.254: 15.21,13.74 15.21,16.31 D2.2 15.21,16.59 15.21,13.74 | LT3496.P$23 15.21,13.74 | 15.21,13.74 15.49,16.26
  Top 1.016: D2.2 14.65,16.59 13.97,17.27 13.97,21.08 15.24,22.35 19.56,22.35 19.7,22.35 L2.P$1
N$36
  Top 0.406: Q3.3 11.26,37.42
  Top 1.016: Q3.3 11.18,41.98 X1.2
N$38
  Top 0.254: 19.81,16.26 19.81,16.51 | 19.81,16.51 D1.2 | 19.81,16.26 19.81,16.51 | 19.81,16.51 D1.2 | D1.2 20.07,16.59 | LT3496.P$19 17.81,14 | 17.81,14 17.81,14.08 D1.2 | 17.81,14 20.07,16.26 | D1.2 19.81,16.51 | 19.05,15.49 19.81,16.26
  Top 0.305: 19.81,16.51 D1.2
  Top 0.61: 19.89,16.59 D1.2
  Top 1.016: 19.89,16.59 20.07,16.59 20.66,16.59 21.59,17.53 22.1,18.03 22.1,19.3 25.15,22.35 28.19,22.35 28.63,22.79 L1.P$1
N$39  (via drill 0.3)
  Top 0.254: v18.29,16.26 18.29,15.49 17.16,14.37 LT3496.P$20
  Top 0.305: v16.76,34.04 16.76,34.75 Q2.1
  Bottom 0.305: v18.29,16.26 16.76,17.78 v16.76,34.04
N$40
  Top 1.016: L3.P$2 6.21,29.1 7.74,30.62 C3.2 7.74,42.04 X1.1
N$42  (via drill 0.3)
  Top 0.254: v23.37,16.76 22.86,16.76 21.08,14.99 20.32,14.99 19.11,13.78 LT3496.P$17
  Top 0.305: v24.89,34.04 26.12,34.04 R1.2
  Top 1.016: R1.2 26.16,35.26 Q1.2
  Bottom 0.305: v23.37,16.76 22.35,17.78 22.35,23.62 24.13,25.4 24.13,32.51 v24.89,34.04
N$46  (via drill 0.3)
  Top 0.254: v23.37,15.75 22.61,15.75 21.34,14.48 20.57,14.48 19.76,13.67 LT3496.P$16
  Top 0.305: v23.62,34.04 23.62,34.75 Q1.1
  Bottom 0.305: v23.37,15.75 21.84,17.27 21.84,23.88 23.62,25.65 v23.62,34.04
N$58
  Top 1.016: 14.59,28.84 L2.P$2 14.85,28.96 C2.2 14.85,41.98 X1.3
N$63
  Top 1.016: Q2.3 18.29,42.04 X1.4
N$69
  Top 1.016: Q1.3 25.15,41.95 X1.6
PVIN  (via drill 0.3)
  Top 0.254: C3.1 v10.92,32.26 | v18.29,18.29 17.02,17.02 17.02,15.75 15.86,14.59 LT3496.P$22 | v11.68,15.24 12.7,15.24 13.91,14.03 LT3496.P$25 | v23.37,17.78 23.11,17.78 20.83,15.49 20.07,15.49 18.46,13.89 LT3496.P$18
  Top 0.305: v10.92,32.26 12.19,32.26 R3.1 | R2.1 19.27,32.26 v18.03,32.26 C2.1 | R1.1 26.12,32.26 v24.89,32.26 C1.1
  Top 0.406: 12.2,32.26 R3.1
  Top 0.61: U$11.5 U$11.4 38.48,18.58 C14.2 38.41,19.94
  Top 1.016: 38.41,19.94 38.41,22.86
  Bottom 0.305: v11.68,15.24 10.92,16 10.92,32 v10.92,32.26 | v18.29,18.29 17.78,18.8 17.78,31.75 v18.03,32.26 | v23.37,17.78 22.86,18.29 22.86,23.37 24.64,25.15 24.64,32 v24.89,32.26
  pour Top: 48.26,22.1 48.26,32 46.23,32 44.65,30.44 42.82,30.44 41.91,29.57 30.23,29.53 30.23,31.37 25.27,31.37 25.27,32.77 21.59,32.77 21.59,31.37 18.41,31.37 18.41,32.77 14.48,32.77 14.48,31.37 11.3,31.37 11.3,32.77 7.87,32.77 7.87,31.24 4.83,28.45 4.83,19.15 8.89,19.15 8.89,19.51 23.98,19.51 23.98,19.2 29.2,19.2 29.72,18.8 31.24,17.27 32.26,18.03 32.26,22.61 35.81,22.61 35.81,21.84 38.35,21.84 38.35,22.61 40.39,22.61 40.39,23.11 43.18,23.11 44.2,22.35 44.2,16.13 41.78,16.13 41.78,11.68 41.15,11.05 35.56,11.05 35.56,6.73 41.15,6.73 41.15,3.05 44.51,3.05 44.51,9.4 52.07,9.4 52.17,9.5 52.17,22.1
PWM1  (via drill 0.3)
  Top 0.254: U$4.6 34.4,36.43 32.26,34.29 32.26,32.77 v32,32.51 | LT3496.P$4 13.91,5.9 v17.02,2.79
  Bottom 0.254: v32,32.51 32,31.75 32.26,31.5 32.26,7.11 27.18,1.78 18.03,1.78 v17.02,2.79
PWM2  (via drill 0.3)
  Top 0.254: U$4.7 34.51,35.78 32.77,34.04 v32.77,32 | LT3496.P$3 13.26,5.53 v16,2.79
  Bottom 0.254: v32.77,32 32.77,6.86 27.43,1.27 17.53,1.27 v16,2.79
PWM3  (via drill 0.3)
  Top 0.254: U$4.8 34.62,35.13 33.27,33.78 33.27,32.77 v33.53,32.51 | LT3496.P$2 12.61,5.17 v14.99,2.79
  Bottom 0.254: v33.53,32.51 33.53,31.75 33.27,31.5 33.27,6.6 27.69,0.76 17.02,0.76 v14.99,2.79
SCK  (via drill 0.3)
  Top 0.254: v30.73,18.29 30.73,17.53 30.48,17.27 30.48,8.13 25.4,3.05 23.71,3.05 U$1.2
  Top 0.305: U$2.7 30.02,32.21 30.48,31.75 30.48,30.23 v30.73,29.97 38.61,29.97 39.62,30.99 39.62,38.1 39.91,38.38 U$4.26 44.67,38.38 44.96,38.1 JP3.2
  Top 0.406: v46.48,36.58 JP3.2
  Bottom 0.254: v30.73,29.97 30.48,29.72 30.48,18.54 v30.73,18.29
  Bottom 0.406: SCL.2 v46.48,36.58
SDA  (via drill 0.3)
  Top 0.254: v29.97,17.78 29.97,8.38 25.15,3.56 U$1.3
  Top 0.305: v30.73,32.51 30.99,32.26 30.99,30.99 31.5,30.48 38.35,30.48 39.12,31.24 39.12,38.35 39.8,39.03 U$4.27 44.62,39.03 44.96,39.37 JP2.1 | U$2.6 29.37,32.77 v29.21,32.51
  Top 0.406: v46.48,40.13 JP2.1
  Bottom 0.254: v29.97,17.78 29.97,31.5 29.21,32.26 v29.21,32.51
  Bottom 0.305: v30.73,32.51 v29.21,32.51
  Bottom 0.406: SDA.2 v46.48,40.13
VIN
  Top 0.406: JP1.1 U1.VIN
  Top 0.813: U1.VIN 50.29,28.12 D5.2

### Text on the board
tPlace: - | R | + | - | G | + | - | B | + | TEMP | CC-BY3.0 | + VIN -
bPlace: High Power RGB LED Shield V2.5 | ledshield.wordpress.com
tDocu: HP RGB LED / SHIELD V2.5